# Altium schematic sheet [0] Accumulator Safety Latching -Overview.SchDoc
size A4
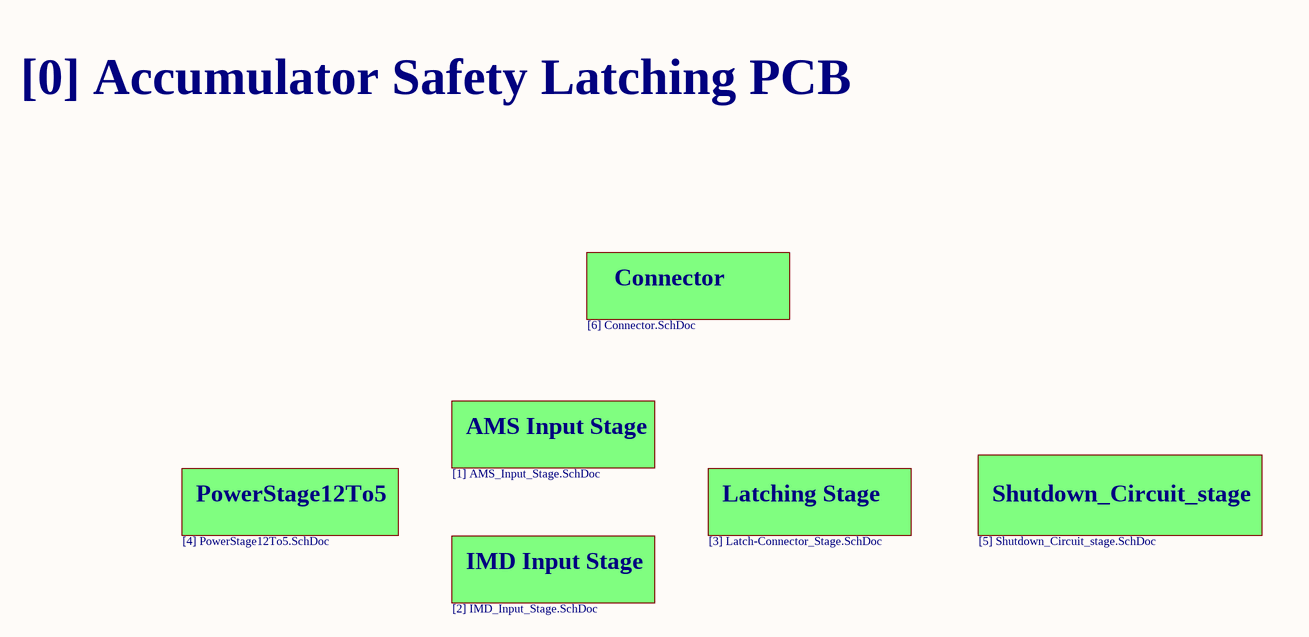
[diagram p0: [0] Accumulator Safety Latching -Overview.SchDoc]

## Sub-sheets
AMS Input Stage = [1] AMS_Input_Stage.SchDoc: no entries
Connector = [6] Connector.SchDoc: no entries
IMD Input Stage = [2] IMD_Input_Stage.SchDoc: no entries
Latching Stage = [3] Latch-Connector_Stage.SchDoc: no entries
PowerStage12To5 = [4] PowerStage12To5.SchDoc: no entries
Shutdown_Circuit_stage = [5] Shutdown_Circuit_stage.SchDoc: no entries

## Notes on the sheet
- [0] Accumulator Safety Latching PCB